# EAGLE board Supercell 1.3 (EAGLE 8.2.2), part 1 of 2
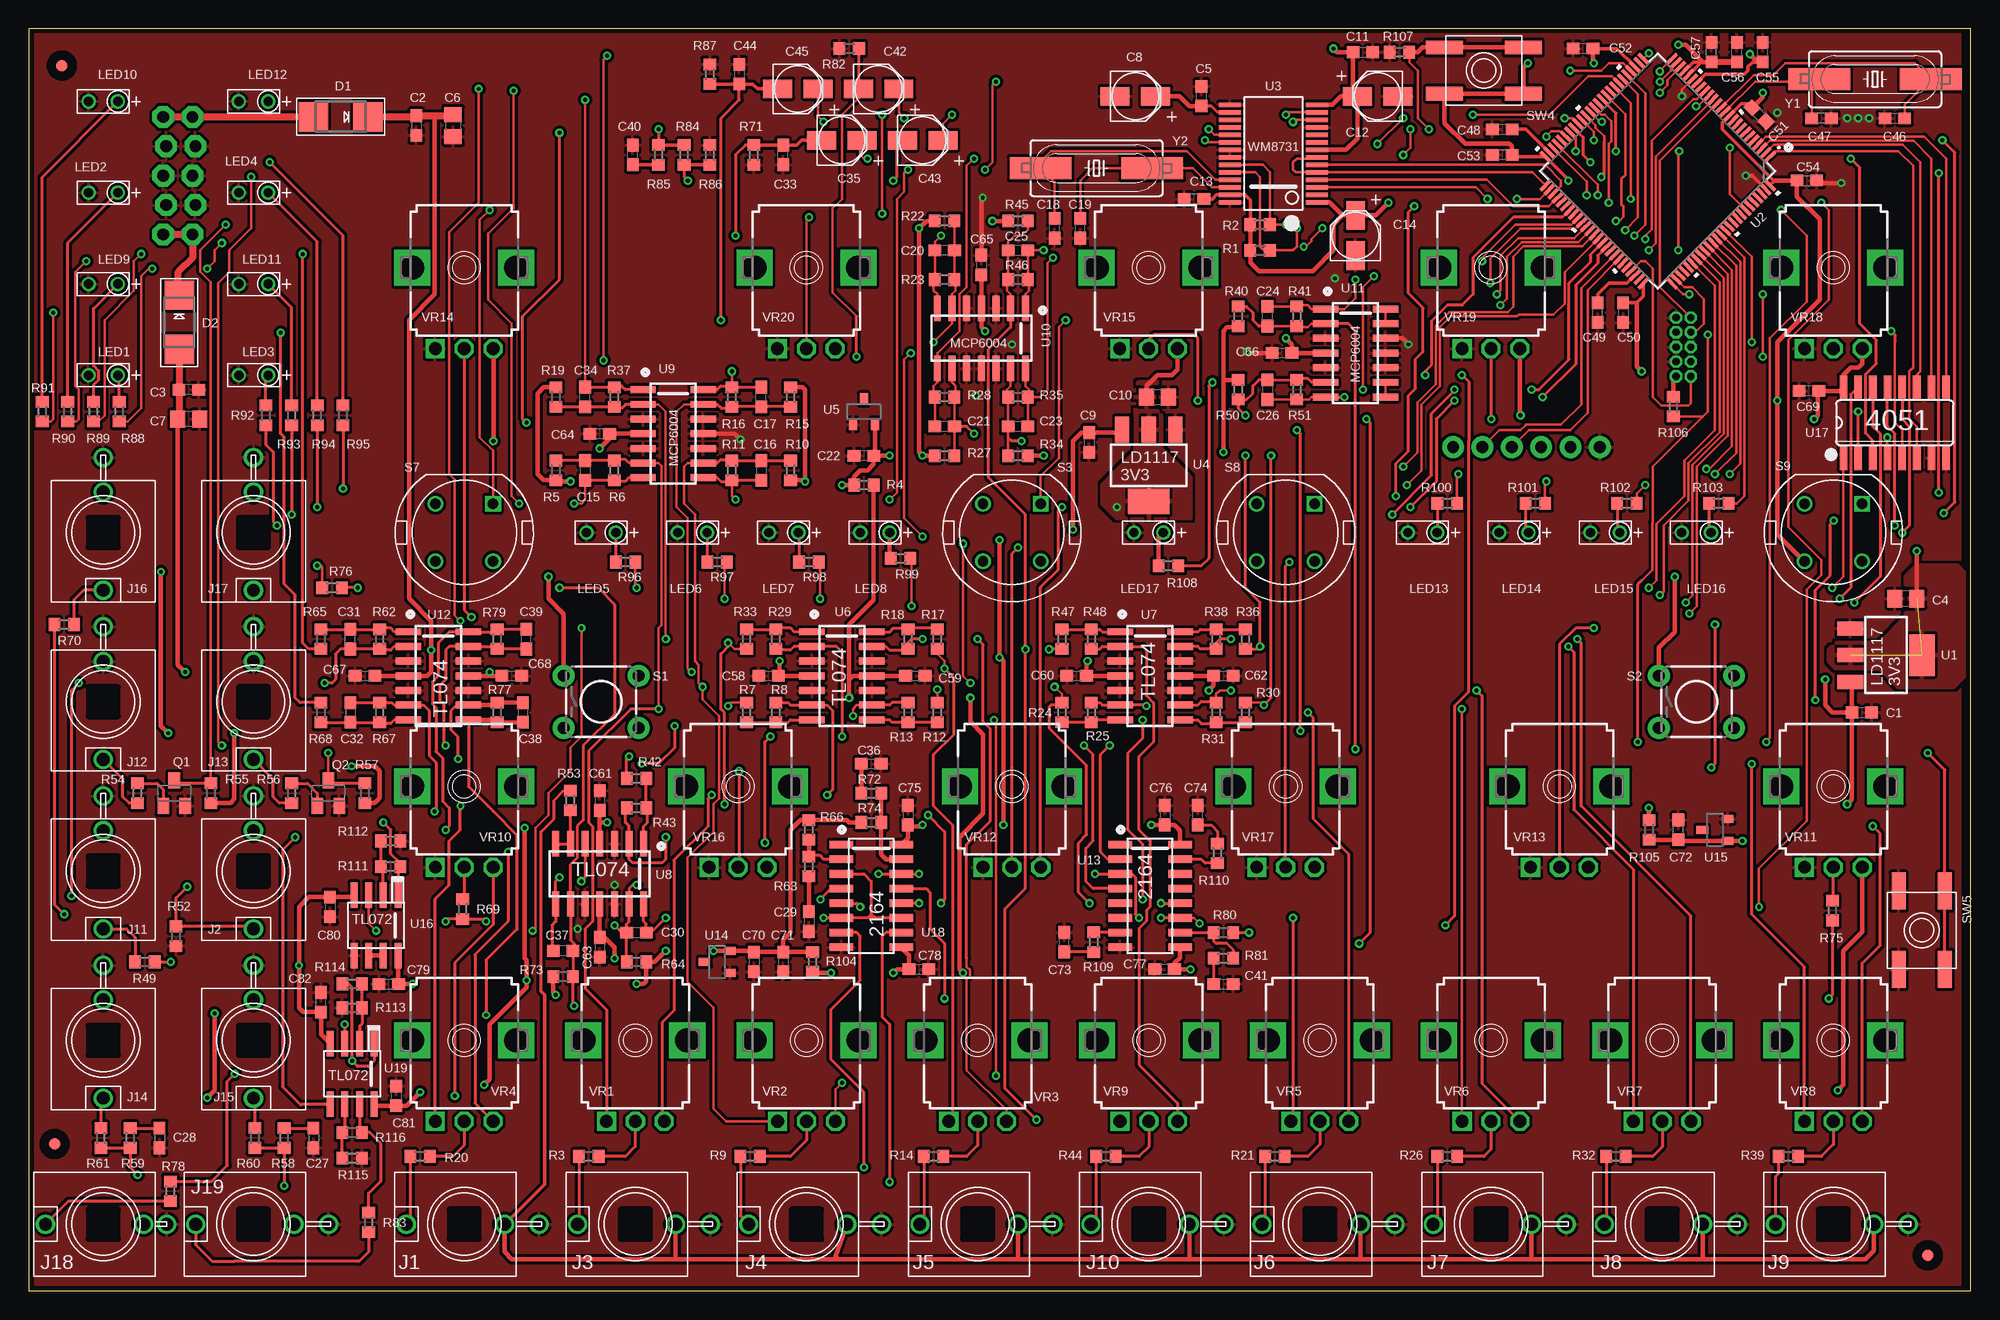
[diagram p5: board, top side]
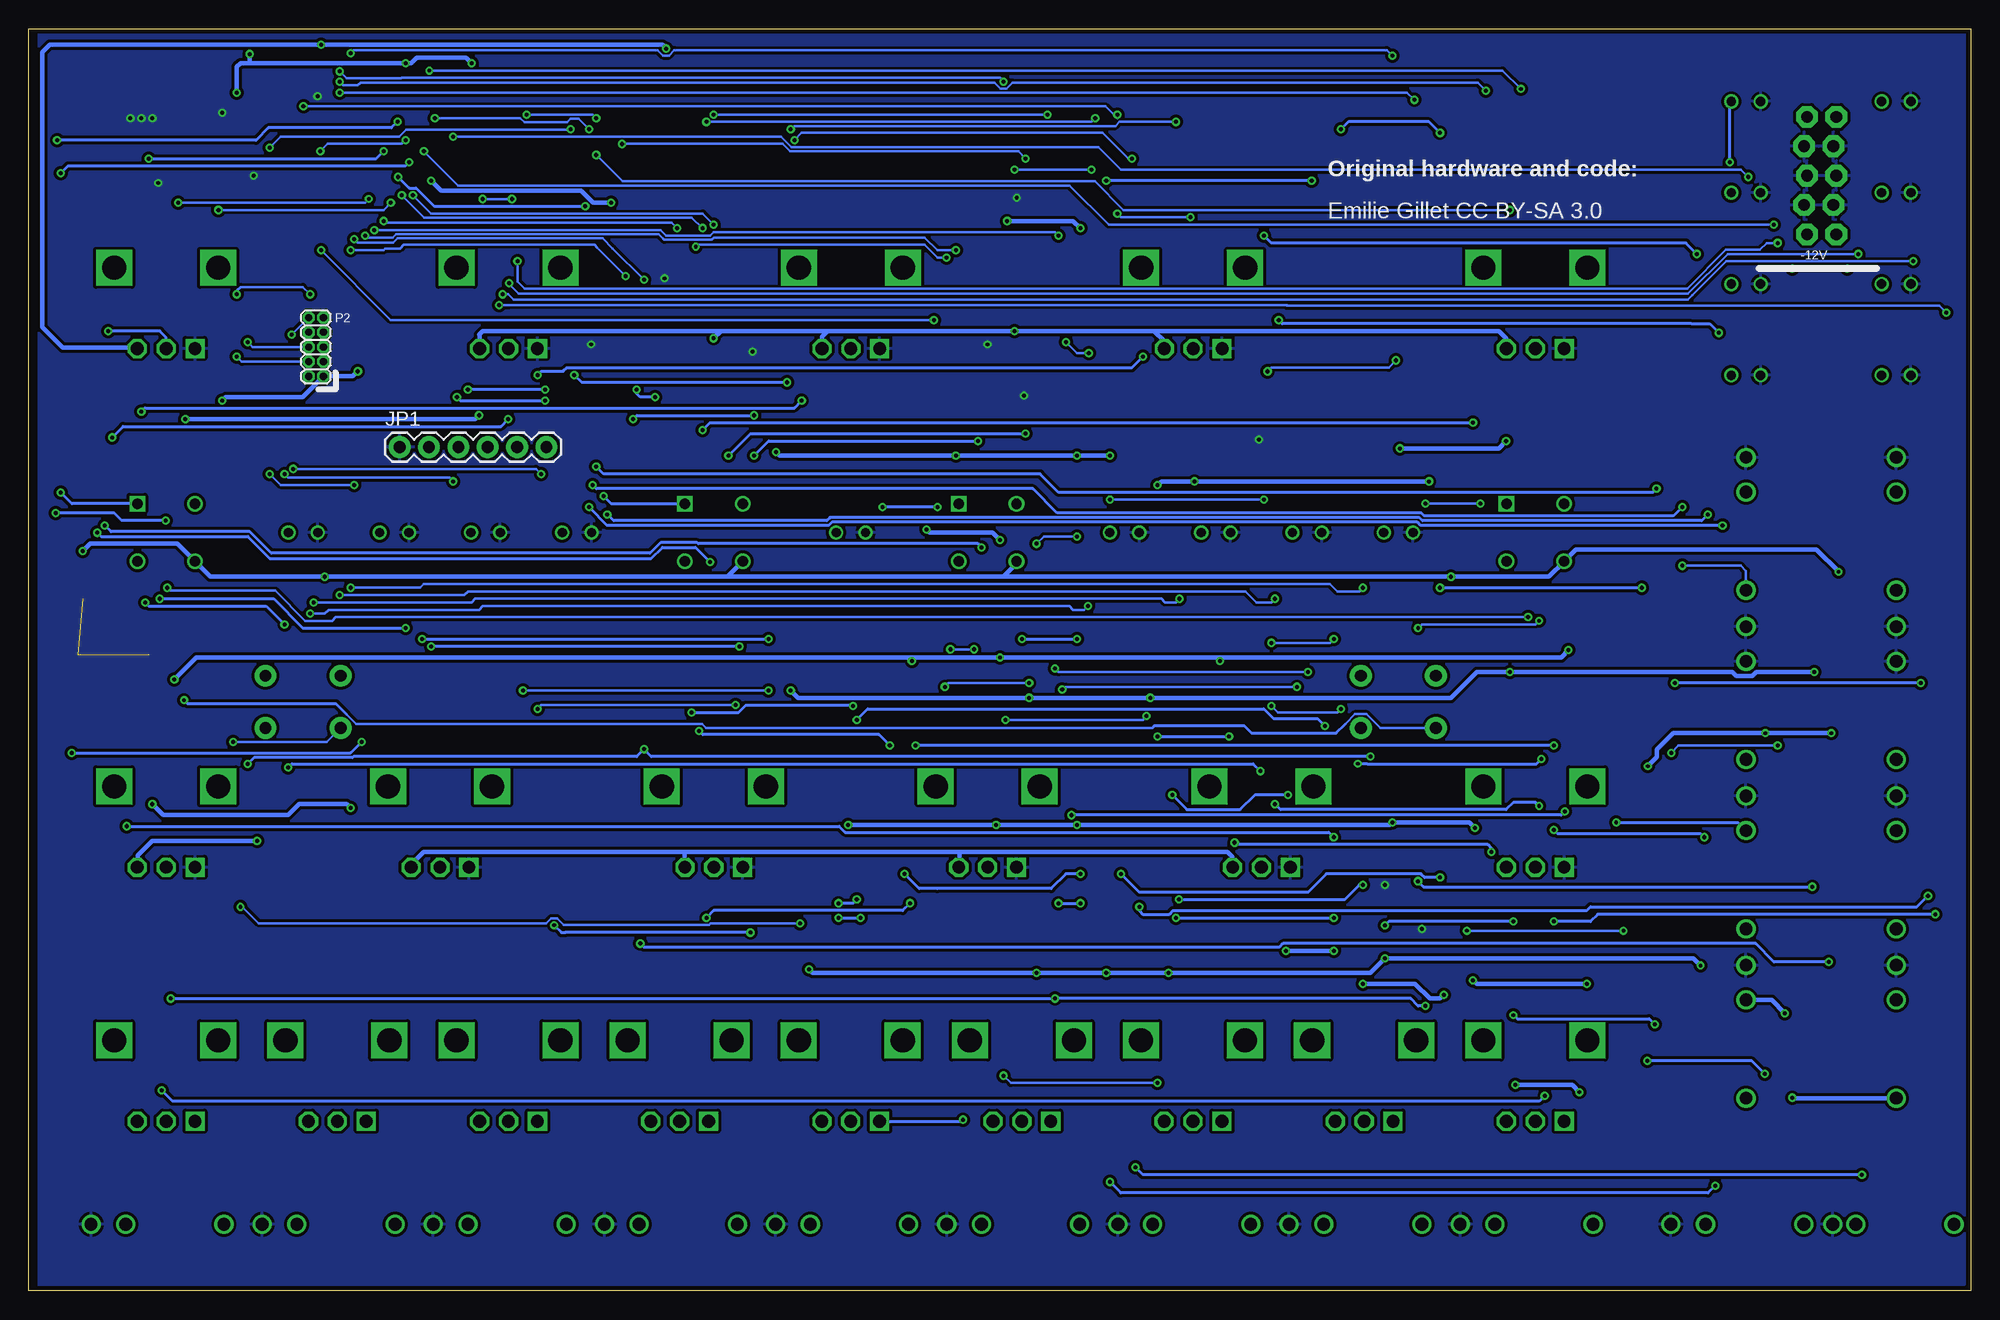
[diagram p6: board, bottom side, seen from below]

Size 168.05 x 109.22 mm. Coordinates in mm from the lower left corner, seen from the top.
Outline: 0,0 168.05,0 168.05,109.22 0,109.22 0,0
Copper layers (1*16): Top 0.0356mm / dielectric 1.5011mm / Bottom 0.0356mm
Design rules "LaenPCBOrder": minimum track width 6mil, minimum drill 13mil, track to track 6mil, track to pad 6mil, pad to pad 6mil, via to via 6mil, smd to smd 6mil, copper to edge 15mil, drill to drill 6mil, minimum pad ring 7mil, minimum via ring 7mil, stop-mask expansion 3mil, vias tented up to drill 0mil, thermal gap 10mil
Net classes: 1 width: width 0.152 mm, clearance 0.152 mm

## Footprints (pad centres in the part's own frame; a part is rotated, then mirrored left to right if it is on the bottom)
C0603 = smd 1.1 x 1: 1 -0.85,0; 2 0.85,0
C0805 = smd 1.3 x 1.5: 1 -0.95,0; 2 0.95,0
EC-4X7 = smd 1.6 x 2.5: P$1 0,1.75; P$2 0,-1.75
SMADIODE = smd 2.54 x 2.54: A 2.349,0; C -2.349,0
FIDUCIAL_1MM = smd 1 x 1: 1 0,0
S_JACK = drill 1.1: GND 0,-6.5; NORM 0,-3.5; TIP 0,5
S_JACK_CLOSE = drill 1.1: GND 0,-5.5; NORM 0,-3.5; TIP 0,5
1X06 = drill 1.016 pad 1.88: 1 0,0; 2 2.54,0; 3 5.08,0; 4 7.62,0; 5 10.16,0; 6 12.7,0
LED_3MM_MIN = drill 0.813: A -1.27,0; K 1.27,0
EURO_PWR_HEADER_LOCK = drill 1.016 pad 1.88 octagon: GND1 -2.54,1.143; GND2 -2.54,-1.397; GND3 0,1.397; GND4 0,-1.143; GND5 2.54,1.143; GND6 2.54,-1.397; NEG1 -5.08,1.397; NEG2 -5.08,-1.143; POS1 5.08,1.397; POS2 5.08,-1.143
2X5-1.27 = drill 0.61 pad 1.067 octagon: 1 -1.27,3.81; 2 0,3.81; 3 -1.27,2.54; 4 0,2.54; 5 -1.27,1.27; 6 0,1.27; 7 -1.27,0; 8 0,0; 9 -1.27,-1.27; 10 0,-1.27
SOT23-BEC = smd 1 x 1.4: B -0.95,-1.1; C 0,1.1; E 0.95,-1.1
R0603 = smd 1 x 1.1: 1 -0.85,0; 2 0.85,0
TACTILE-PTH = drill 1.016 pad 1.88: 1 -3.251,2.261; 2 3.251,2.261; 3 -3.251,-2.261; 4 3.251,-2.261
C&K_D6R = drill 0.9 square: 1 2.5,2.5 | drill 0.9: 2 2.5,-2.5; 3 -2.5,-2.5; 4 -2.5,2.5
EVQ-Q2 = smd 3.2 x 1.2: A -3.4,-2; A' 3.4,-2; B -3.4,2; B' 3.4,2
SOT223 = smd 1.219 x 2.235: 1 -2.311,-3.099; 2 0,-3.099; 3 2.311,-3.099 | smd 3.6 x 2.2: TAB 0,3.099
LQFP100-14X14MM = smd 1.194 x 0.305: 1 -7.75,6; 2 -7.75,5.5; 3 -7.75,5; 4 -7.75,4.5; 5 -7.75,4; 6 -7.75,3.5; 7 -7.75,3; 8 -7.75,2.5; 9 -7.75,2; 10 -7.75,1.5; 11 -7.75,1; 12 -7.75,0.5; 13 -7.75,0; 14 -7.75,-0.5; 15 -7.75,-1; 16 -7.75,-1.5; 17 -7.75,-2; 18 -7.75,-2.5; 19 -7.75,-3; 20 -7.75,-3.5; 21 -7.75,-4; 22 -7.75,-4.5; 23 -7.75,-5; 24 -7.75,-5.5; 25 -7.75,-6; 51 7.75,-6; 52 7.75,-5.5; 53 7.75,-5; 54 7.75,-4.5; 55 7.75,-4; 56 7.75,-3.5; 57 7.75,-3; 58 7.75,-2.5; 59 7.75,-2; 60 7.75,-1.5; 61 7.75,-1; 62 7.75,-0.5; 63 7.75,0; 64 7.75,0.5; 65 7.75,1; 66 7.75,1.5; 67 7.75,2; 68 7.75,2.5; 69 7.75,3; 70 7.75,3.5; 71 7.75,4; 72 7.75,4.5; 73 7.75,5; 74 7.75,5.5; 75 7.75,6 | smd 0.305 x 1.194: 26 -6,-7.75; 27 -5.5,-7.75; 28 -5,-7.75; 29 -4.5,-7.75; 30 -4,-7.75; 31 -3.5,-7.75; 32 -3,-7.75; 33 -2.5,-7.75; 34 -2,-7.75; 35 -1.5,-7.75; 36 -1,-7.75; 37 -0.5,-7.75; 38 0,-7.75; 39 0.5,-7.75; 40 1,-7.75; 41 1.5,-7.75; 42 2,-7.75; 43 2.5,-7.75; 44 3,-7.75; 45 3.5,-7.75; 46 4,-7.75; 47 4.5,-7.75; 48 5,-7.75; 49 5.5,-7.75; 50 6,-7.75; 76 6,7.75; 77 5.5,7.75; 78 5,7.75; 79 4.5,7.75; 80 4,7.75; 81 3.5,7.75; 82 3,7.75; 83 2.5,7.75; 84 2,7.75; 85 1.5,7.75; 86 1,7.75; 87 0.5,7.75; 88 0,7.75; 89 -0.5,7.75; 90 -1,7.75; 91 -1.5,7.75; 92 -2,7.75; 93 -2.5,7.75; 94 -3,7.75; 95 -3.5,7.75; 96 -4,7.75; 97 -4.5,7.75; 98 -5,7.75; 99 -5.5,7.75; 100 -6,7.75
SSOP28 = smd 0.381 x 1.905: 1 -4.55,-3.752; 2 -3.9,-3.752; 3 -3.25,-3.752; 4 -2.6,-3.752; 5 -1.95,-3.752; 6 -1.3,-3.752; 7 -0.65,-3.752; 8 0,-3.752; 9 0.65,-3.752; 10 1.3,-3.752; 11 1.95,-3.752; 12 2.6,-3.752; 13 3.25,-3.752; 14 3.9,-3.752; 15 3.9,3.752; 16 3.25,3.752; 17 2.6,3.752; 18 1.95,3.752; 19 1.3,3.752; 20 0.65,3.752; 21 0,3.752; 22 -0.65,3.752; 23 -1.3,3.752; 24 -1.95,3.752; 25 -2.6,3.752; 26 -3.25,3.752; 27 -3.9,3.752; 28 -4.55,3.752
DBZ_R-PDSO-G3 = smd 0.7 x 1: 1 -0.95,-1.1; 2 0.95,-1.1; 3 0,1.1
SO14 = smd 0.6 x 2.2: 1 -3.81,-2.6; 2 -2.54,-2.6; 3 -1.27,-2.6; 4 0,-2.6; 5 1.27,-2.6; 6 2.54,-2.6; 7 3.81,-2.6; 8 3.81,2.6; 9 2.54,2.6; 10 1.27,2.6; 11 0,2.6; 12 -1.27,2.6; 13 -2.54,2.6; 14 -3.81,2.6
SO16 = smd 0.66 x 2.032: 1 -4.445,-2.591; 2 -3.175,-2.591; 3 -1.905,-2.591; 4 -0.635,-2.591; 5 0.635,-2.591; 6 1.905,-2.591; 7 3.175,-2.591; 8 4.445,-2.591; 9 4.445,2.591; 10 3.175,2.591; 11 1.905,2.591; 12 0.635,2.591; 13 -0.635,2.591; 14 -1.905,2.591; 15 -3.175,2.591; 16 -4.445,2.591
SO08_BOXPIN = smd 0.61 x 2.21: 1 -1.905,-2.616; 2 -0.635,-2.616; 3 0.635,-2.616; 4 1.905,-2.616; 5 1.905,2.616; 6 0.635,2.616; 7 -0.635,2.616; 8 -1.905,2.616
SO16' = smd 0.66 x 2.032: 1 -4.445,-3.073; 2 -3.175,-3.073; 3 -1.905,-3.073; 4 -0.635,-3.073; 5 0.635,-3.073; 6 1.905,-3.073; 7 3.175,-3.073; 8 4.445,-3.073; 9 4.445,3.073; 10 3.175,3.073; 11 1.905,3.073; 12 0.635,3.073; 13 -0.635,3.073; 14 -1.905,3.073; 15 -3.175,3.073; 16 -4.445,3.073
9MM_SNAP-IN_POT_NO_SILK = drill 1.1 square: 1 -2.5,-7 | drill 1.1 octagon: 2 0,-7; 3 2.5,-7 | drill 2.1 square: CHASSIS1 -4.5,0; CHASSIS2 4.5,0
HC49UP = smd 5.334 x 1.93: 1 -4.826,0; 2 4.826,0

## Placement (x,y rotation side)
C1  0.1uF  [C0603]  158.63,50.05 0 top
C2  0.1uF  [C0603]  33.53,100.85 270 top
C3  0.1uF  [C0603]  13.85,77.99 180 top
C4  10uF  [C0805]  162.44,59.89 180 top
C5  0.1uF  [C0603]  101.48,103.39 90 top
C6  10uF  [C0805]  36.71,100.85 270 top
C7  10uF  [C0805]  13.85,75.45 180 top
C8  10uF  [EC-4X7]  95.76,103.39 270 top
C9  0.1uF  [C0603]  91.75,73.42 270 top
C10  10uF  [C0805]  97.67,77.36 0 top
C11  0.1uF  [C0603]  115.45,107.2 0 top
C12  10uF  [EC-4X7]  116.72,103.39 90 top
C13  0.1uF  [C0603]  100.84,94.5 180 top
C14  10uF  [EC-4X7]  114.81,91.33 0 top
C15  10nF  [C0603]  48.14,71 270 top
C16  10nF  [C0603]  63.38,71 270 top
C17  10nF  [C0603]  63.38,77.36 90 top
C18  18pF  [C0603]  88.78,91.96 90 top
C19  18pF  [C0603]  91,91.96 90 top
C20  10nF  [C0603]  79.25,90.06 180 top
C21  10nF  [C0603]  79.25,74.81 180 top
C22  0.1uF  [C0603]  72.27,72.28 180 top
C23  10nF  [C0603]  85.6,74.81 0 top
C24  10nF  [C0603]  107.19,84.34 90 top
C25  10nF  [C0603]  85.6,90.06 0 top
C26  1000pF  [C0603]  107.19,77.99 270 top
C27  560pF  [C0603]  24.64,13.22 270 top
C28  560pF  [C0603]  11.31,13.22 270 top
C29  560pF  [C0603]  67.5,31.95 270 top
C30  47pF  [C0603]  52.58,31 0 top
C31  47pF  [C0603]  27.82,56.4 90 top
C32  47pF  [C0603]  27.82,50.05 270 top
C33  220pF  [C0603]  65.28,98.31 90 top
C34  10nF  [C0603]  48.14,77.36 90 top
C35  10uF  [EC-4X7]  70.36,99.58 270 top
C36  560pF  [C0603]  72.9,45.6 0 top
C37  47pF  [C0603]  46.23,29.41 180 top
C38  47pF  [C0603]  42.74,50.05 270 top
C39  47pF  [C0603]  43.06,56.4 90 top
C40  560pF  [C0603]  52.27,98.31 90 top
C41  560pF  [C0603]  103.38,26.55 0 top
C42  10uF  [EC-4X7]  73.54,104.03 270 top
C43  10uF  [EC-4X7]  77.35,99.58 270 top
C44  220pF  [C0603]  61.47,105.3 270 top
C45  10uF  [EC-4X7]  66.55,104.03 270 top
C46  18pF  [C0603]  161.49,101.48 0 top
C47  18pF  [C0603]  155.13,101.48 180 top
C48  2.2uF  [C0603]  127.51,100.53 0 top
C49  2.2uF  [C0603]  135.77,84.66 90 top
C50  0.1uF  [C0603]  137.99,84.66 270 top
C51  0.1uF  [C0603]  149.74,101.8 315 top
C52  0.1uF  [C0603]  134.5,107.52 180 top
C53  0.1uF  [C0603]  127.51,98.31 180 top
C54  0.1uF  [C0603]  153.87,96.09 0 top
C55  0.1uF  [C0603]  150.06,107.2 90 top
C56  0.1uF  [C0603]  147.83,107.2 90 top
C57  0.1uF  [C0603]  145.61,107.2 90 top
C58  0.1uF  [C0603]  64.01,53.23 0 top
C59  0.1uF  [C0603]  76.71,53.23 0 top
C60  0.1uF  [C0603]  90.68,53.23 0 top
C61  0.1uF  [C0603]  49.41,42.43 270 top
C62  0.1uF  [C0603]  103.38,53.23 0 top
C63  0.1uF  [C0603]  49.41,29.73 270 top
C64  0.1uF  [C0603]  49.41,74.18 0 top
C65  0.1uF  [C0603]  82.43,88.78 270 top
C66  0.1uF  [C0603]  108.46,81.17 0 top
C67  0.1uF  [C0603]  29.09,53.23 0 top
C68  0.1uF  [C0603]  41.79,53.23 0 top
C69  0.1uF  [C0603]  154.06,77.88 180 top
C70  0.47uF  [C0603]  62.74,28.46 270 top
C71  0.47uF  [C0603]  65.28,28.46 270 top
C72  0.1uF  [C0603]  142.75,39.89 90 top
C73  560pF  [C0603]  89.61,30.17 90 top
C74  560pF  [C0603]  101.16,41.16 90 top
C75  0.1uF  [C0603]  76.08,41.16 270 top
C76  0.1uF  [C0603]  98.3,41.16 270 top
C77  0.1uF  [C0603]  98.3,27.82 180 top
C78  0.1uF  [C0603]  77.03,27.82 0 top
C79  0.1uF  [C0603]  31.15,26.55 0 top
C80  0.1uF  [C0603]  26.07,33.22 270 top
C81  0.1uF  [C0603]  31.79,16.87 270 top
C82  0.1uF  [C0603]  25.28,24.97 90 top
D1  S1B  [SMADIODE]  26.99,101.6 180 top
D2  S1B  [SMADIODE]  13.02,83.82 270 top
FD1  FIDUCIAL  [FIDUCIAL_1MM]  2.86,106.05 0 top
FD2  FIDUCIAL  [FIDUCIAL_1MM]  2.22,12.7 0 top
FD3  FIDUCIAL  [FIDUCIAL_1MM]  164.34,3.06 0 top
J1  EURO_JACK  [S_JACK]  37.67,5.76 90 top
J2  EURO_JACK  [S_JACK]  19.44,36.32 180 top
J3  EURO_JACK  [S_JACK]  52.49,5.76 90 top
J4  EURO_JACK  [S_JACK]  67.3,5.76 90 top
J5  EURO_JACK  [S_JACK]  82.11,5.76 90 top
J6  EURO_JACK  [S_JACK]  111.73,5.76 90 top
J7  EURO_JACK  [S_JACK]  126.54,5.76 90 top
J8  EURO_JACK  [S_JACK]  141.35,5.76 90 top
J9  EURO_JACK  [S_JACK]  156.17,5.76 90 top
J10  EURO_JACK  [S_JACK]  96.92,5.76 90 top
J11  EURO_JACK  [S_JACK]  6.44,36.32 180 top
J12  EURO_JACK  [S_JACK]  6.44,50.98 180 top
J13  EURO_JACK  [S_JACK]  19.44,50.98 180 top
J14  EURO_JACK  [S_JACK]  6.44,21.67 180 top
J15  EURO_JACK  [S_JACK]  19.44,21.67 180 top
J16  EURO_JACK  [S_JACK]  6.44,65.63 180 top
J17  EURO_JACK  [S_JACK]  19.44,65.63 180 top
J18  EURO_JACK_CLOSE  [S_JACK_CLOSE]  6.44,5.76 90 top
J19  EURO_JACK  [S_JACK]  19.44,5.76 90 top
JP1  [1X06]  135.96,73.03 0 bottom
LED1  Kingbright 754-1220  [LED_3MM_MIN]  6.44,79.24 180 top
LED2  Kingbright 754-1220  [LED_3MM_MIN]  6.44,95.04 180 top
LED3  Kingbright 754-1220  [LED_3MM_MIN]  19.44,79.24 180 top
LED4  Kingbright 754-1220  [LED_3MM_MIN]  19.44,95.04 180 top
LED5  Kingbright 754-1220  [LED_3MM_MIN]  49.52,65.63 180 top
LED6  Kingbright 754-1220  [LED_3MM_MIN]  57.42,65.63 180 top
LED7  Kingbright 754-1220  [LED_3MM_MIN]  65.32,65.63 180 top
LED8  Kingbright 754-1220  [LED_3MM_MIN]  73.22,65.63 180 top
LED9  Kingbright 754-1220  [LED_3MM_MIN]  6.44,87.14 180 top
LED10  Kingbright 754-1220  [LED_3MM_MIN]  6.44,102.94 180 top
LED11  Kingbright 754-1220  [LED_3MM_MIN]  19.44,87.14 180 top
LED12  Kingbright 754-1220  [LED_3MM_MIN]  19.44,102.94 180 top
LED13  Kingbright 754-1220  [LED_3MM_MIN]  120.62,65.63 180 top
LED14  Kingbright 754-1220  [LED_3MM_MIN]  128.52,65.63 180 top
LED15  Kingbright 754-1220  [LED_3MM_MIN]  136.42,65.63 180 top
LED16  Kingbright 754-1220  [LED_3MM_MIN]  144.32,65.63 180 top
LED17  Kingbright 754-1220  [LED_3MM_MIN]  96.91,65.63 180 top
P1  EURO_POWER_HEADERLOCK_PADS  [EURO_PWR_HEADER_LOCK]  13.02,96.52 90 top
P2  M05X2MINIJTAG  [2X5-1.27]  143.83,82.95 180 bottom
Q1  MMBT3904  [SOT23-BEC]  12.58,43.06 0 top
Q2  MMBT3904  [SOT23-BEC]  25.91,43.06 0 top
R1  2K  [R0603]  106.56,90.06 180 top
R2  2K  [R0603]  106.56,92.28 180 top
R3  100K  [R0603]  48.45,11.63 0 top
R4  510R  [R0603]  72.27,69.73 180 top
R5  200K  [R0603]  45.6,71 90 top
R6  33k  [R0603]  50.68,71 270 top
R7  16.5K  [R0603]  62.11,50.05 90 top
R8  16.5K  [R0603]  64.65,50.05 270 top
R9  100K  [R0603]  62.42,11.63 0 top
R10  200K  [R0603]  65.92,71 90 top
R11  33k  [R0603]  60.84,71 270 top
R12  16.5K  [R0603]  78.62,50.05 90 top
R13  16.5K  [R0603]  76.08,50.05 270 top
R14  100K  [R0603]  78.3,11.63 0 top
R15  200K  [R0603]  65.92,77.36 270 top
R16  33k  [R0603]  60.84,77.36 90 top
R17  16.5K  [R0603]  78.62,56.4 270 top
R18  16.5K  [R0603]  76.08,56.4 90 top
R19  200K  [R0603]  45.6,77.36 270 top
R20  100K  [R0603]  33.85,11.63 0 top
R21  100K  [R0603]  107.83,11.63 0 top
R22  200K  [R0603]  79.25,92.59 0 top
R23  33k  [R0603]  79.25,87.52 180 top
R24  16.5K  [R0603]  89.41,50.05 90 top
R25  16.5K  [R0603]  91.95,50.05 270 top
R26  100K  [R0603]  122.75,11.63 0 top
R27  200K  [R0603]  79.25,72.28 0 top
R28  33k  [R0603]  79.25,77.36 180 top
R29  16.5K  [R0603]  64.65,56.4 90 top
R30  16.5K  [R0603]  105.29,50.05 90 top
R31  16.5K  [R0603]  102.75,50.05 270 top
R32  100K  [R0603]  137.35,11.63 0 top
R33  16.5K  [R0603]  62.11,56.4 270 top
R34  200K  [R0603]  85.6,72.28 180 top
R35  33k  [R0603]  85.6,77.36 0 top
R36  16.5K  [R0603]  105.29,56.4 270 top
R37  33k  [R0603]  50.68,77.36 90 top
R38  16.5K  [R0603]  102.75,56.4 90 top
R39  100K  [R0603]  152.28,11.63 0 top
R40  200K  [R0603]  104.65,84.34 90 top
R41  33k  [R0603]  109.73,84.34 90 top
R42  16.5K  [R0603]  52.58,44.34 180 top
R43  16.5K  [R0603]  52.58,41.8 0 top
R44  100K  [R0603]  93.22,11.63 0 top
R45  200K  [R0603]  85.6,92.59 0 top
R46  33k  [R0603]  85.6,87.52 0 top
R47  16.5K  [R0603]  89.41,56.4 270 top
R48  16.5K  [R0603]  91.95,56.4 90 top
R49  100K  [R0603]  10.04,28.46 0 top
R50  180K  [R0603]  104.65,77.99 270 top
R51  47K  [R0603]  109.73,77.99 270 top
R52  1M  [R0603]  12.74,30.68 90 top
R53  100R  [R0603]  46.87,42.43 270 top
R54  100K  [R0603]  9.4,43.06 90 top
R55  100K  [R0603]  15.75,43.06 270 top
R56  100K  [R0603]  22.74,43.06 90 top
R57  100K  [R0603]  29.09,43.06 270 top
R58  510R  [R0603]  22.1,13.22 270 top
R59  510R  [R0603]  8.77,13.22 270 top
R60  22K  [R0603]  19.56,13.22 90 top
R61  22K  [R0603]  6.23,13.22 90 top
R62  10K  [R0603]  30.36,56.4 270 top
R63  510R  [R0603]  67.5,36.72 90 top
R64  1M  [R0603]  52.58,28.46 0 top
R65  5.1K  [R0603]  25.28,56.4 90 top
R66  49.9K  [R0603]  67.5,39.89 90 top
R67  10K  [R0603]  30.36,50.05 90 top
R68  5.1K  [R0603]  25.28,50.05 270 top
R69  100K  [R0603]  37.55,33.03 90 top
R70  100K  [R0603]  3.05,57.67 0 top
R71  10K  [R0603]  62.74,98.31 270 top
R72  510R  [R0603]  72.9,43.06 0 top
R73  1M  [R0603]  46.23,27.19 180 top
R74  49.9K  [R0603]  72.9,40.52 180 top
R75  100K  [R0603]  156.09,32.91 90 top
R76  100K  [R0603]  26.23,60.84 180 top
R77  200K  [R0603]  40.52,50.05 90 top
R78  1K  [R0603]  12.26,8.62 90 top
R79  200K  [R0603]  40.52,56.4 270 top
R80  22K  [R0603]  103.38,31 0 top
R81  510R  [R0603]  103.38,28.78 0 top
R82  39K  [R0603]  71,107.52 180 top
R83  1K  [R0603]  29.41,5.92 90 top
R84  22K  [R0603]  56.71,98.31 270 top
R85  510R  [R0603]  54.49,98.31 90 top
R86  39K  [R0603]  58.93,98.31 90 top
R87  10K  [R0603]  58.93,105.3 90 top
R88  100R  [R0603]  7.82,76.08 270 top
R89  100R  [R0603]  5.59,76.08 270 top
R90  1K  [R0603]  3.37,76.08 270 top
R91  1K  [R0603]  1.15,76.08 270 top
R92  100R  [R0603]  20.52,75.77 270 top
R93  100R  [R0603]  22.74,75.77 270 top
R94  1K  [R0603]  24.96,75.77 270 top
R95  1K  [R0603]  27.18,75.77 270 top
R96  1K  [R0603]  51.63,63.07 0 top
R97  1K  [R0603]  59.57,63.07 0 top
R98  1K  [R0603]  67.5,63.07 0 top
R99  1K  [R0603]  75.44,63.38 0 top
R100  1K  [R0603]  122.75,68.15 0 top
R101  1K  [R0603]  130.37,68.15 0 top
R102  1K  [R0603]  138.31,68.15 0 top
R103  1K  [R0603]  146.25,68.15 0 top
R104  22K  [R0603]  67.82,28.46 90 top
R105  510R  [R0603]  140.21,39.89 270 top
R106  10K  [R0603]  142.32,76.53 90 top
R107  10K  [R0603]  118.62,107.2 0 top
R108  510R  [R0603]  98.62,62.75 0 top
R109  510R  [R0603]  92.16,30.17 90 top
R110  510R  [R0603]  102.86,37.86 270 top
R111  100K  [R0603]  31.31,36.72 180 top
R112  200K  [R0603]  31.31,38.94 0 top
R113  100K  [R0603]  27.98,24.49 180 top
R114  100K  [R0603]  27.98,26.55 180 top
R115  100K  [R0603]  27.98,11.47 0 top
R116  100K  [R0603]  27.98,13.7 0 top
S1  [TACTILE-PTH]  49.52,50.98 0 top
S2  [TACTILE-PTH]  144.32,50.98 0 top
S3  [C&K_D6R]  85.07,65.63 0 top
S7  [C&K_D6R]  37.67,65.63 0 top
S8  [C&K_D6R]  108.77,65.63 0 top
S9  [C&K_D6R]  156.17,65.63 0 top
SW4  EVQ-22  [EVQ-Q2]  125.92,105.61 180 top
SW5  EVQ-22  [EVQ-Q2]  163.82,31.2 270 top
U1  LD1117-3V3  [SOT223]  160.73,55.02 270 top
U2  STM32F4XXV2  [LQFP100-14X14MM]  140.96,96.92 225 top
U3  WM8731  [SSOP28]  107.71,98.75 90 top
U4  LD1117-3V3  [SOT223]  96.92,71.44 180 top
U5  LM4040-10A12DBZ  [DBZ_R-PDSO-G3]  72.27,76.08 0 top
U6  TL074  [SO14]  70.36,53.23 270 top
U7  TL074  [SO14]  97.03,53.23 270 top
U8  TL074  [SO14]  49.41,36.08 180 top
U9  MCP6004  [SO14]  55.76,74.18 270 top
U10  MCP6004  [SO14]  82.43,82.44 180 top
U11  MCP6004  [SO14]  114.81,81.17 270 top
U12  TL074  [SO14]  35.44,53.23 270 top
U13  2164  [SO16]  97.03,34.17 270 top
U14  LM4040-2.5A12DBZ  [DBZ_R-PDSO-G3]  59.57,28.46 90 top
U15  LM4040-10A12DBZ  [DBZ_R-PDSO-G3]  145.93,39.89 90 top
U16  TL072  [SO08_BOXPIN]  30.04,31.64 180 top
U17  4051D  [SO16']  161.49,75.13 0 top
U18  2164  [SO16]  72.9,34.17 270 top
U19  TL072  [SO08_BOXPIN]  27.98,18.78 180 top
VR1  10k  [9MM_SNAP-IN_POT_NO_SILK]  52.49,21.67 0 top
VR2  10k  [9MM_SNAP-IN_POT_NO_SILK]  67.3,21.67 0 top
VR3  10k  [9MM_SNAP-IN_POT_NO_SILK]  82.11,21.67 0 top
VR4  10k  [9MM_SNAP-IN_POT_NO_SILK]  37.67,21.67 0 top
VR5  10k  [9MM_SNAP-IN_POT_NO_SILK]  111.73,21.67 0 top
VR6  10k  [9MM_SNAP-IN_POT_NO_SILK]  126.54,21.67 0 top
VR7  10k  [9MM_SNAP-IN_POT_NO_SILK]  141.35,21.67 0 top
VR8  10k  [9MM_SNAP-IN_POT_NO_SILK]  156.17,21.67 0 top
VR9  10k  [9MM_SNAP-IN_POT_NO_SILK]  96.92,21.67 0 top
VR10  10k  [9MM_SNAP-IN_POT_NO_SILK]  37.67,43.65 0 top
VR11  10k  [9MM_SNAP-IN_POT_NO_SILK]  156.17,43.65 0 top
VR12  10k  [9MM_SNAP-IN_POT_NO_SILK]  85.07,43.65 0 top
VR13  10k  [9MM_SNAP-IN_POT_NO_SILK]  132.47,43.65 0 top
VR14  10k  [9MM_SNAP-IN_POT_NO_SILK]  37.67,88.55 0 top
VR15  10k  [9MM_SNAP-IN_POT_NO_SILK]  96.91,88.55 0 top
VR16  10k  [9MM_SNAP-IN_POT_NO_SILK]  61.37,43.65 0 top
VR17  10k  [9MM_SNAP-IN_POT_NO_SILK]  108.77,43.65 0 top
VR18  10k  [9MM_SNAP-IN_POT_NO_SILK]  156.17,88.55 0 top
VR19  10k  [9MM_SNAP-IN_POT_NO_SILK]  126.54,88.55 0 top
VR20  10k  [9MM_SNAP-IN_POT_NO_SILK]  67.28,88.55 0 top
Y1  8MHz  [HC49UP]  159.78,104.86 180 top
Y2  12.288MHz  [HC49UP]  92.39,97.16 180 top